# Altium schematic sheet Boost_Converter_V1.0.SchDoc
size A3; DocumentNumber: 3; SheetNumber: 3; SheetTotal: 3
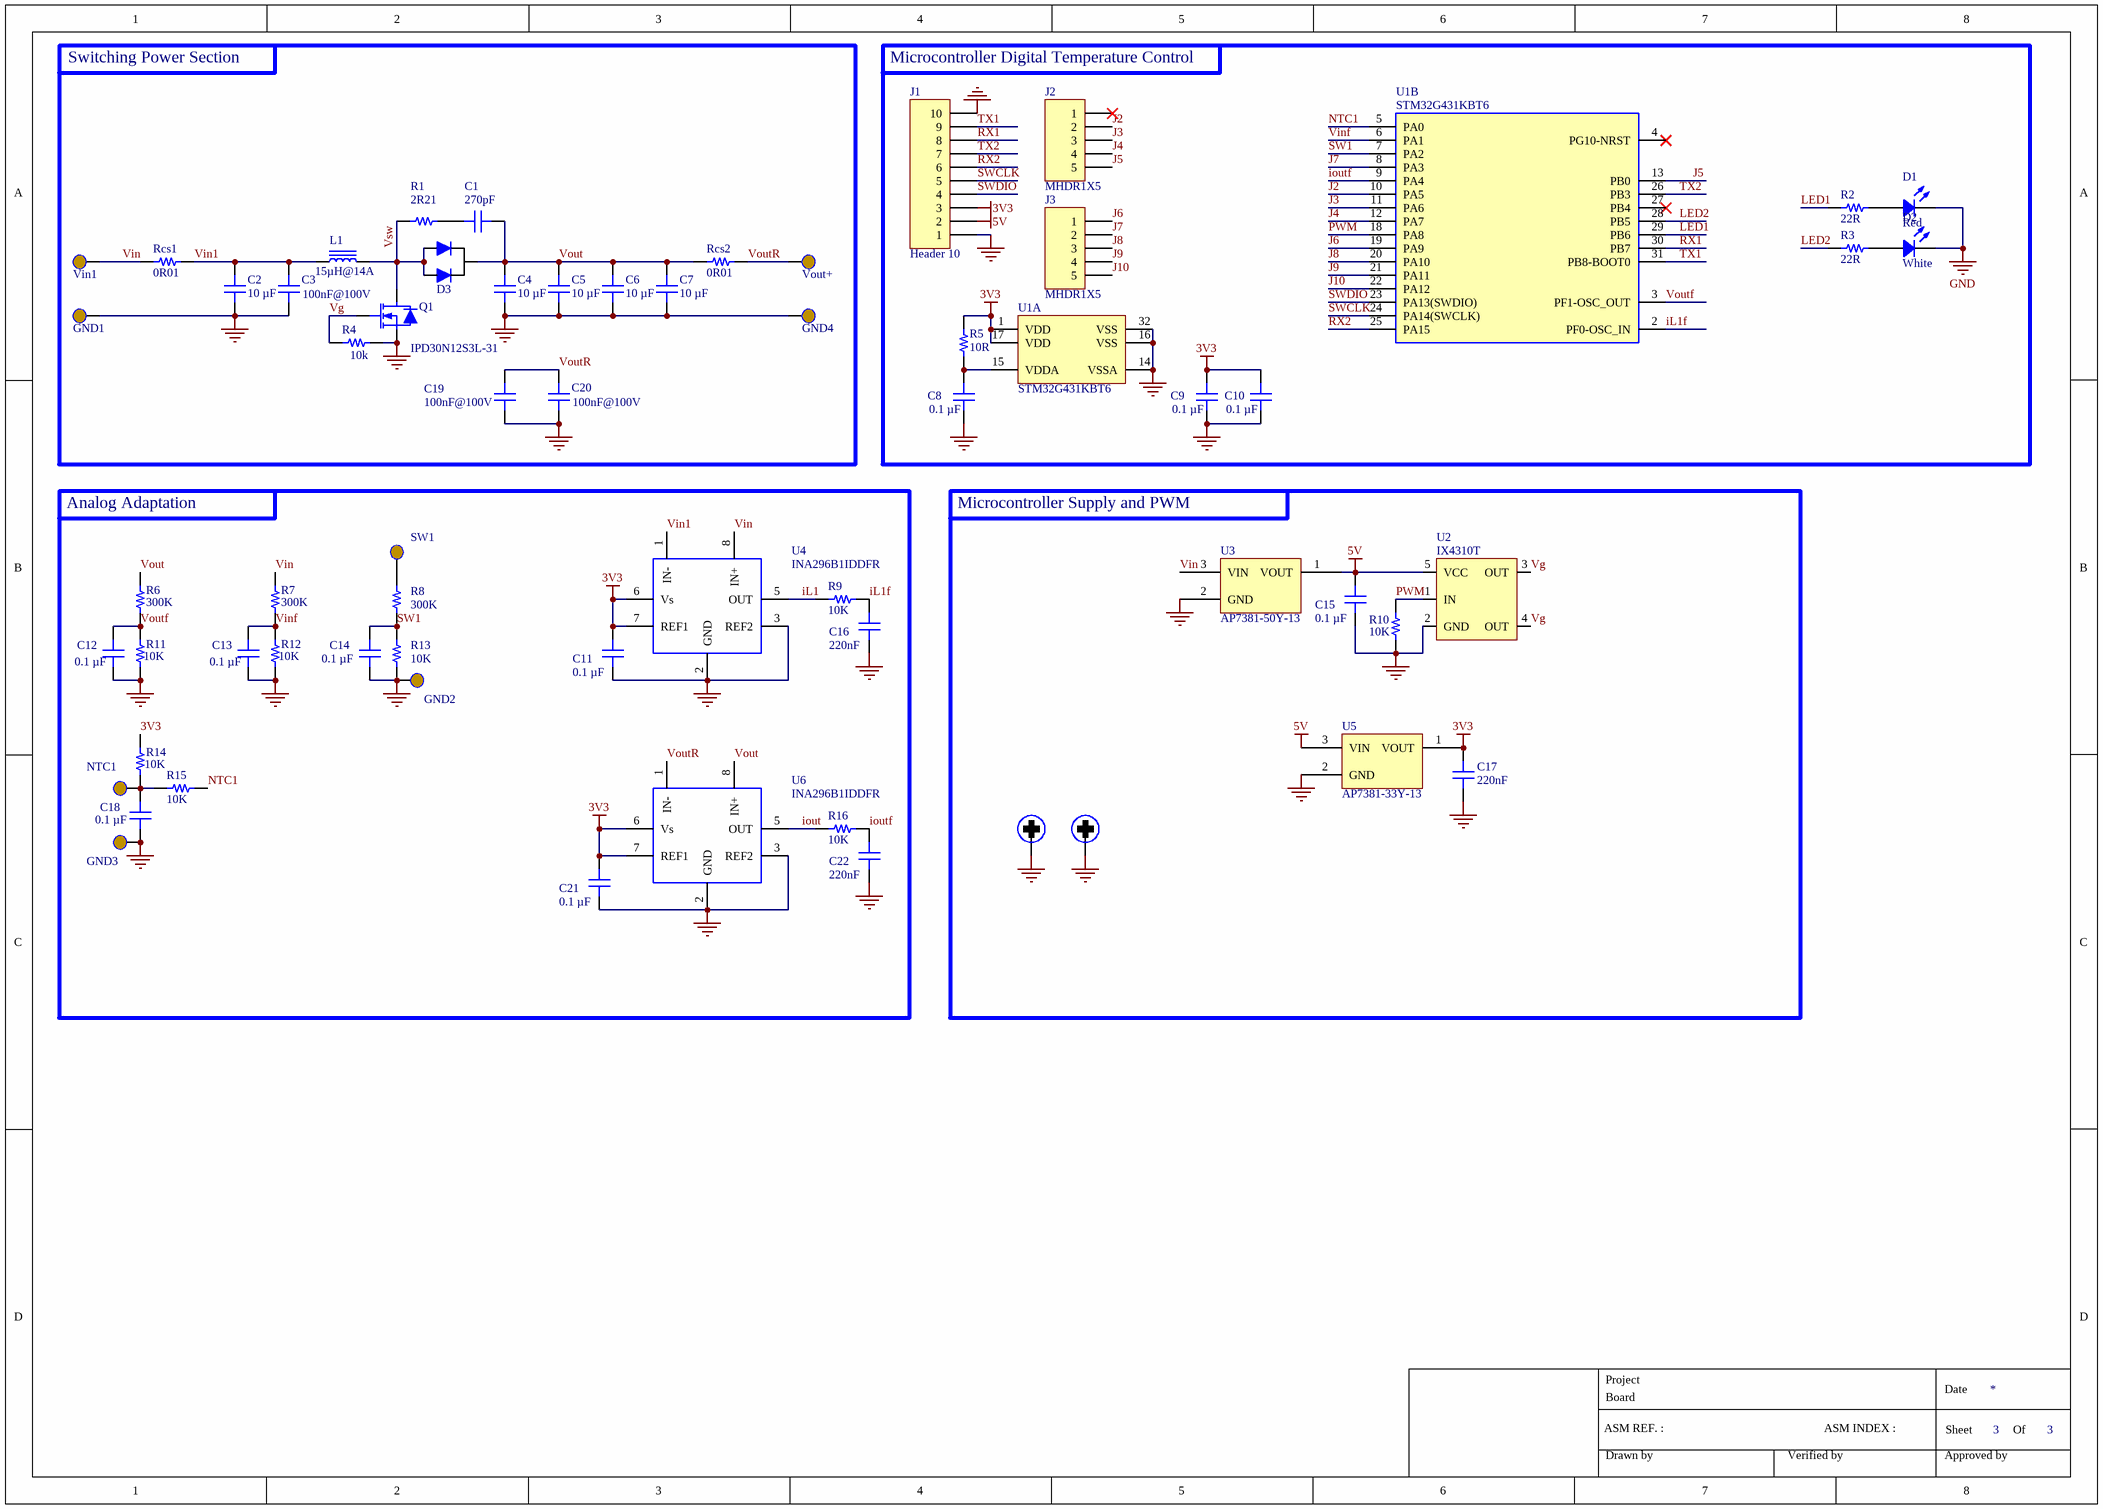
[diagram p0: Boost_Converter_V1.0.SchDoc]

## Parts
?  (no value)  (graphical)
C1  270pF  [CAP 0603_1608]
C2  10 µF  [MURATA - GRM32E]
C3  100nF@100V  [CAP 0603_1608]
C4  10 µF  [MURATA - GRM32E]
C5  10 µF  [MURATA - GRM32E]
C6  10 µF  [MURATA - GRM32E]
C7  10 µF  [MURATA - GRM32E]
C8  0.1 µF  [CAP 0603_1608]
C9  0.1 µF  [CAP 0603_1608]
C10  0.1 µF  [CAP 0603_1608]
C11  0.1 µF  [CAP 0603_1608]
C12  0.1 µF  [CAP 0603_1608]
C13  0.1 µF  [CAP 0603_1608]
C14  0.1 µF  [CAP 0603_1608]
C15  0.1 µF  [CAP 0603_1608]
C16  220nF  [CAP 0603_1608]
C17  220nF  [CAP 0603_1608]
C18  0.1 µF  [CAP 0603_1608]
C19  100nF@100V  [CAP 0603_1608]
C20  100nF@100V  [CAP 0603_1608]
C21  0.1 µF  [CAP 0603_1608]
C22  220nF  [CAP 0603_1608]
D1  Red  [LED 0603_1608 RED]
D2  White  [LED 0603_1608]
D3  V40PW10C-M3/I  [TO-252]  (value not drawn)
GND1  Wire_Solder  [Wire_3x5]  (value not drawn)  (no BOM)
GND2  Wire_Solder  [Wire_3x3]  (value not drawn)  (no BOM)
GND3  Wire_Solder  [Wire_3x3]  (value not drawn)  (no BOM)
GND4  Wire_Solder  [Wire_3x5]  (value not drawn)  (no BOM)
J1  Header 10  [HDR1X10]  (no BOM)
J2  MHDR1X5  [MHDR1X5]  (no BOM)
J3  MHDR1X5  [MHDR1X5]  (no BOM)
L1  15µH@14A  [WURTH WE-HCI 1890]
M1  HOLE  [HOLE_M1]  (value not drawn)  (no BOM)
M2  HOLE  [HOLE_M1]  (value not drawn)  (no BOM)
NTC1  Wire_Solder  [Wire_3x3]  (value not drawn)  (no BOM)
Q1  IPD30N12S3L-31  [TO-252]
R1  2R21  [RES 0603_1608]
R2  22R  [RES 0603_1608]
R3  22R  [RES 0603_1608]
R4  10k  [RES 0603_1608]
R5  10R  [RES 0603_1608]
R6  300K  [RES 0603_1608]
R7  300K  [RES 0603_1608]
R8  300K  [RES 0603_1608]
R9  10K  [RES 0603_1608]
R10  10K  [RES 0603_1608]
R11  10K  [RES 0603_1608]
R12  10K  [RES 0603_1608]
R13  10K  [RES 0603_1608]
R14  10K  [RES 0603_1608]
R15  10K  [RES 0603_1608]
R16  10K  [RES 0603_1608]
Rcs1  0R01  [RES 2512_6432]
Rcs2  0R01  [RES 2512_6432]
SW1  Wire_Solder  [Wire_3x3]  (value not drawn)  (no BOM)
U1  STM32G431KBT6  [STM-LQFP32_N]  (parts A,B of 2)
U2  IX4310T  [SOT-23-5]
U3  AP7381-50Y-13  [DIODES INC SOT-89]
U4  INA296B1IDDFR  [SOT65P280X110-8N]
U5  AP7381-33Y-13  [DIODES INC SOT-89]
U6  INA296B1IDDFR  [SOT65P280X110-8N]
Vin1  Wire_Solder  [Wire_3x5]  (value not drawn)  (no BOM)
Vout+  Wire_Solder  [Wire_3x5]  (value not drawn)  (no BOM)

## Blocks framed on the sheet
Switching Power Section: C1-C7 C19 C20 D3 GND1 GND4 L1 Q1 R1 R4 Rcs1 Rcs2 Vin1 Vout+
Microcontroller Digital Temperature Control: C8-C10 D1 D2 J1-J3 R2 R3 R5 U1
Analog Adaptation: C11-C14 C16 C18 C21 C22 GND2 GND3 NTC1 R6-R9 R11-R16 SW1 U4 U6
Microcontroller Supply and PWM: C15 C17 M1 M2 R10 U2 U3 U5

## Nets
3V3: C9.2 C10.2 C11.2 C17.2 C21.2 J1.3 R5.2 R14.2 U1.1(VDD) U1.17(VDD) U4.6(Vs) U4.7(REF1) U5.1(VOUT) U6.6(Vs) U6.7(REF1)
5V: C15.2 J1.2 U2.5(VCC) U3.1(VOUT) U5.3(VIN)
GND: C2.1 C3.1 C4.1 C5.1 C6.1 C7.1 C8.1 C9.1 C10.1 C11.1 C12.1 C13.1 C14.1 C15.1 C16.1 C17.1 C18.1 C19.1 C20.1 C21.1 C22.1 D1.2 D2.2 GND1.1 GND2.1 GND3.1 GND4.1 J1.1 J1.10 M1.1 M2.1 Q1.3(S) R4.2 R10.1 R11.1 R12.1 R13.1 U1.14(VSSA) U1.16(VSS) U1.32(VSS) U2.2(GND) U3.2(GND) U4.2(GND) U4.3(REF2) U5.2(GND) U6.2(GND) U6.3(REF2)
iL1: R9.2 U4.5(OUT)
iL1f: C16.2 R9.1 U1.2(PF0-OSC_IN)
iout: R16.2 U6.5(OUT)
ioutf: C22.2 R16.1 U1.9(PA4)
J2: J2.2 U1.10(PA5)
J3: J2.3 U1.11(PA6)
J4: J2.4 U1.12(PA7)
J5: J2.5 U1.13(PB0)
J6: J3.1 U1.19(PA9)
J7: J3.2 U1.8(PA3)
J8: J3.3 U1.20(PA10)
J9: J3.4 U1.21(PA11)
J10: J3.5 U1.22(PA12)
LED1: R2.1 U1.29(PB6)
LED2: R3.1 U1.28(PB5)
NTC1: R15.1 U1.5(PA0)
PWM: R10.2 U1.18(PA8) U2.1(IN)
RX1: J1.8 U1.30(PB7)
RX2: J1.6 U1.25(PA15)
SW1: C14.2 R8.1 R13.2 U1.7(PA2)
SWCLK: J1.5 U1.24(PA14(SWCLK))
SWDIO: J1.4 U1.23(PA13(SWDIO))
TX1: J1.9 U1.31(PB8-BOOT0)
TX2: J1.7 U1.26(PB3)
Vg: Q1.1(G) R4.1 U2.3(OUT) U2.4(OUT)
Vin: R7.2 Rcs1.1 U3.3(VIN) U4.8(IN+) Vin1.1
Vin1: C2.2 C3.2 L1.1 Rcs1.2 U4.1(IN-)
Vinf: C13.2 R7.1 R12.2 U1.6(PA1)
Vout: C1.2 C4.2 C5.2 C6.2 C7.2 D3.2(K) R6.2 Rcs2.1 U6.8(IN+)
Voutf: C12.2 R6.1 R11.2 U1.3(PF1-OSC_OUT)
VoutR: C19.2 C20.2 Rcs2.2 U6.1(IN-) Vout+.1
Vsw: D3.1(A) D3.3(A) L1.2 Q1.2(D) R1.1
NetC1_1: C1.1 R1.2
NetC8_2: C8.2 R5.1 U1.15(VDDA)
NetC18_2: C18.2 NTC1.1 R14.1 R15.2
NetD1_1: D1.1 R2.2
NetD2_1: D2.1 R3.2
NetR8_2: R8.2 SW1.1

Not connected (* = marked no-connect by the designer): J2 1*; U1 4(PG10-NRST)* 27(PB4)*

## Notes on the sheet
- Project
- Date
- ASM REF. :
- Board
- Drawn by
- Verified by
- ASM INDEX :
- Approved by
- Sheet
- Of

## Library data of the parts
? = Title_ech_3: Echosens
C1 = C0603C271J1GACAUTO: CAP CER 270PF 100V C0G/NP0 0603; manufacturer: KEMET; Manufacturer Ref: C0603C271J1GACAUTO; Part Number: C0603C271J1GACAUTO
C2 C4-C7 = GRM32EC72A106KE05L: CAP CER 10UF 100V X7S 1210; manufacturer: Murata Electronics; Part Number: GRM32EC72A106KE05L; Value: 10 µF; Supplier 1: DigiKey; Supplier Part Number 1: 490-16266-1-ND; Manufacturer Ref: GRM32EC72A106KE05L
C3 = GCG188R92A104KA03D: CAP CER 0.1UF 100V X8R 0603; manufacturer: Murata Electronics; Part Number: GCG188R92A104KA03D; value: 100nF@100V; Supplier 1: DigiKey; Supplier Part Number 1: 490-18197-1-ND; Manufacturer Ref: GCG188R92A104KA03D
C8-C15 C18 C21 = CS0603KRX7R7BB104: CAP CER 0.1UF 16V X7R 0603; manufacturer: Yageo; Supplier 1: DigiKey; Supplier Part Number 1: 311-3560-1-ND; Part Number: CS0603KRX7R7BB104; Value: 0.1 µF; Manufacturer Ref: CS0603KRX7R7BB104
C16 C17 C22 = C0603C224K4RECAUTO: CAP CER 0603 220NF 16V X7R 10%; manufacturer: KEMET; Manufacturer Ref: C0603C224K4RECAUTO; Part Number: C0603C224K4RECAUTO
C19 C20 = GCG188R92A104KA03D: CAP CER 0.1UF 100V X8R 0603; manufacturer: Murata Electronics; value: 0.1 µF; Part Number: GCG188R92A104KA03D; Supplier 1: DigiKey; Supplier Part Number 1: 490-18197-1-ND; Manufacturer Ref: GCG188R92A104KA03D
D1 = CL-195HR-CD-T: LED RED SMD; Manufacturer: Citizen; Part Number: CL-195HR-CD-T; Supplier 1: DigiKey; Supplier Part Number 1: 1642-1492-1-ND; Value: Red; Manufacturer Ref: CL-195HR-CD-T
D2 = CL-198N-WS-D-T: LED WHITE SMD; Manufacturer: Citizen; Part Number: CL-198N-WS-D-T; Supplier 1: DigiKey; Supplier Part Number 1: 1642-1495-1-ND; Value: White; Manufacturer Ref: CL-198N-WS-D-T
D3 = V40PW10C-M3/I: Rectifier Diode Schottky 100V 40A 3-Pin(2+Tab) Slim DPAK T/R; Manufacturer: Vishay; Supplier 1: Mouser; Supplier Part Number 1: 78-V40PW10C-M3/I; Footprint: SOT-23-3; Manufacturer Ref: V40PW10C; Part Number: V40PW10C
J1 = Header 10: Header, 10-Pin
J2 J3 = MHDR1X5: Header, 5-Pin
L1 = 74435571500: FIXED IND 15UH 14A 9 MOHM SMD; Manufacturer: Würth Elektronik; Manufacturer Ref: 74435571500; Part Number: 74435571500
Q1 = IPD30N12S3L-31: Mosfet Single, 30A, 120V, 57W, To-252-3 Rohs Compliant: Yes |Infineon; Part Number: IPD30N06S4L-23; Manufacturer: Infineon; Supplier 1: Mouser; Supplier Part Number 1: 726-IPD30N12S3L31AT; Manufacturer Ref: IPD30N06S4L-23
R1 = RK73H1JTTD2R21F: RES 2.21 OHM 1% 1/8W 0603; Manufacturer: KOA Speer Electronics, Inc.; Manufacturer Ref: RK73H1JTTD2R21F; Part Number: RK73H1JTTD2R21F
R2 R3 = ERJ-3EKF22R0V: RES SMD 22 OHM 1% 1/10W 0603; Manufacturer: Panasonic Electronic Components; Part Number: ERJ-3EKF22R0V; Value: 22R; Supplier 1: DigiKey; Supplier Part Number 1: P22.0HCT-ND; Manufacturer Ref: ERJ-3EKF22R0V
R4 = TNPU060310K0AZEA00: RES 10K OHM 0.1% 1/10W 0603; Manufacturer: Vishay Dale; Manufacturer Ref: TNPW060310K0BETA; Part Number: TNPW060310K0BETA
R5 = ESR03EZPF10R0: RES SMD 10 OHM 1% 1/4W 0603; Manufacturer: Rohm Semiconductor; Part Number: ESR03EZPF10R0; Value: 10R; Supplier 1: DigiKey; Supplier Part Number 1: RHM10.0ADCT-ND; Manufacturer Ref: ESR03EZPF10R0
R6-R8 = CRCW0603300KFKEAHP: RES SMD 300K OHM 1% 1/3W 0603; Manufacturer: Vishay Dale; Supplier 1: DigiKey; Supplier Part Number 1: 541-CRCW0603300KFKEAHPCT-ND; Part Number: CRCW0603300KFKEAHP; Value: 300K
R9-R16 = TNPW060310K0BETA: RES 10K OHM 0.1% 1/10W 0603; Manufacturer: Vishay Dale; Manufacturer Ref: TNPW060310K0BETA; Part Number: TNPW060310K0BETA
Rcs1 Rcs2 = WSLP2512R0100FEA: RES 0.01 OHM 1% 3W 2512; Manufacturer: Vishay Dale; Manufacturer Ref: WSLP2512R0100FEA; Part Number: WSLP2512R0100FEA
U1 = STM32G431KBT6: STMICROELECTRONICS  STM32G431KBT6  MCU ARM, STM32 Family STM32G4 Series Microcontrollers, ARM Cortex-M4F, 32 bits, 170 MHz, 128 KB / Fabricant; manufacturer: STM; Supplier 1: Farnell; Supplier Part Number 1: 3132405; Manufacturer Ref: STM32G431KBT6; Part Number: STM32G431KBT6
U2 = IX4310T: 2 Ampere High Speed / Low-Side MOSFET Driver; Manufacturer: IXYS; Manufacturer Ref: IX4310T; Part Number: IX4310T
U3 = AP7381-50Y-13: IC REG LINEAR 5V 150MA SOT89; Manufacturer: Diodes Incorporated; Manufacturer Ref: AP7381-50Y-13; Part Number: AP7381-50Y-13
U4 U6 = INA296B1IDDFR: 10V/V "-5-V TO 110-V, BIDIRECTIONAL, 1." Current Sense Amplifier 1 Circuit Single-Ended 8-VSSOP; Manufacturer: Texas Instruments; Supplier 1: Mouser; Supplier Part Number 1: 595-INA296B1IDDFR; Part Number: INA296B1IDDFR; Manufacturer Ref: INA296B1IDDFR
U5 = AP7381-33Y-13: IC REG LINEAR 3.3V 150MA SOT89; Manufacturer: Diodes Incorporated; Manufacturer Ref: AP7381-33Y-13; Part Number: AP7381-33Y-13